# EAGLE schematic 220v_relay_board (EAGLE 7.5.0)
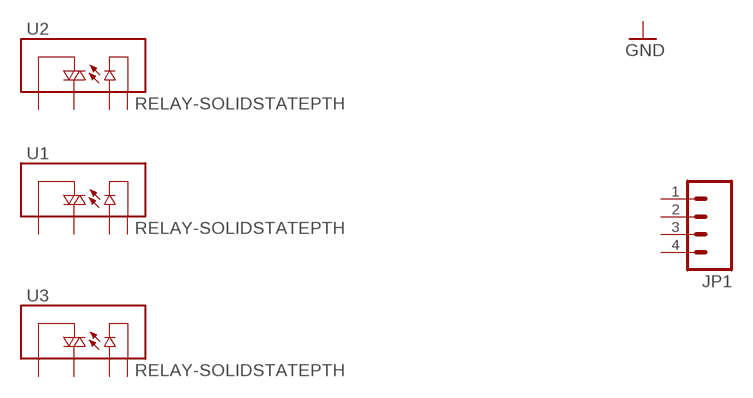
[diagram p0: schematic, sheet 1]

## Parts
JP1  M04JST  [1X04-1.5MM_JST]
U1  RELAY-SOLIDSTATEPTH  [RELAY-S108T02]
U2  RELAY-SOLIDSTATEPTH  [RELAY-S108T02]
U3  RELAY-SOLIDSTATEPTH  [RELAY-S108T02]
Unconnected: JP1.1(SCL) JP1.2(SDA) JP1.3(VCC) JP1.4(GND) U1.1(T1) U1.2(T2) U1.3(+) U1.4(-) U2.1(T1) U2.2(T2) U2.3(+) U2.4(-) U3.1(T1) U3.2(T2) U3.3(+) U3.4(-)

## Library data of the parts
JP1 = SparkFun-Connectors:M04: Header 4 Standard 4-pin 0.1" header. Use with straight break away headers (SKU : PRT-00116), right angle break away headers (PRT-00553), swiss pins (PRT-00743), machine pins (PRT-00117), and female headers (PRT-00115). Molex polarized connector foot print use with SKU : PRT-08231 with associated crimp pins and housings. 1MM SMD Version SKU: PRT-10208
U1-U3 = SparkFun-Electromechanical:RELAY-SOLIDSTATE: SPST SS relay